# Altium project Acoustics_4.PrjPcb
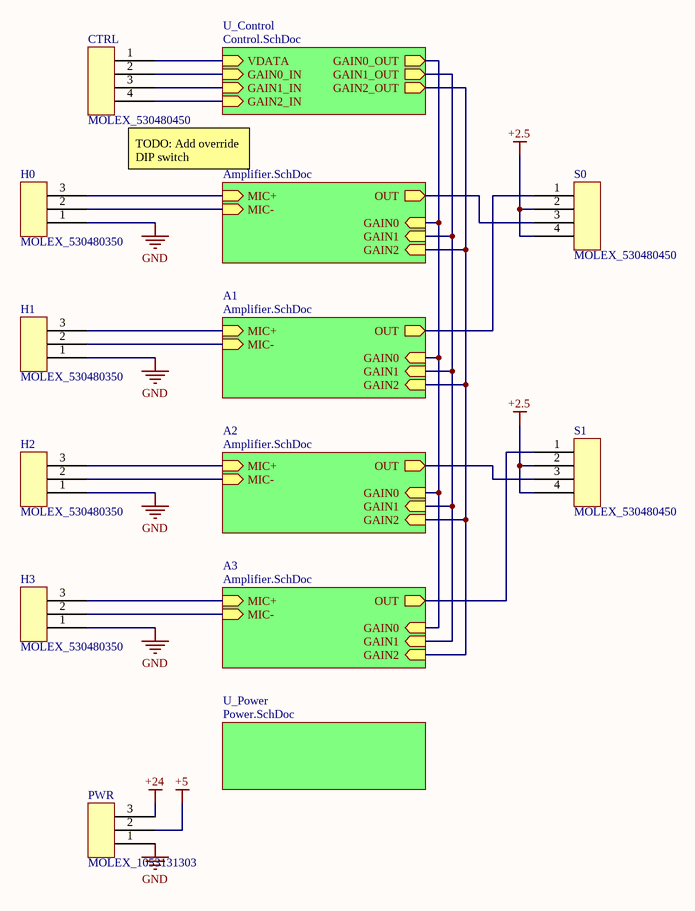
[diagram p0: Acoustics_4.SchDoc]
3 sheets, 110 parts. Net scope: hierarchical (ports join the sheet entries above them; power ports are global).
Board file: Acoustics_4.PcbDoc
Sheets:
  Acoustics_4.SchDoc
    A0 = Amplifier.SchDoc
    A1 = Amplifier.SchDoc
    A2 = Amplifier.SchDoc
    A3 = Amplifier.SchDoc
    U_Power = Power.SchDoc

## Sheet Acoustics_4.SchDoc
size A; SheetNumber: 1; SheetTotal: 4

### Parts
CTRL  MOLEX_530480450  [MOLEX_530480450]
H0  MOLEX_530480350  [MOLEX_530480350]
H1  MOLEX_530480350  [MOLEX_530480350]
H2  MOLEX_530480350  [MOLEX_530480350]
H3  MOLEX_530480350  [MOLEX_530480350]
PWR  MOLEX_1053131303  [MOLEX_1053131303]
S0  MOLEX_530480450  [MOLEX_530480450]
S1  MOLEX_530480450  [MOLEX_530480450]

### Sub-sheets
A0 = Amplifier.SchDoc: MIC- (in), MIC+ (in), GAIN2 (in), GAIN1 (in), GAIN0 (in), OUT (out)
A1 = Amplifier.SchDoc: MIC- (in), MIC+ (in), GAIN2 (in), GAIN1 (in), GAIN0 (in), OUT (out)
A2 = Amplifier.SchDoc: MIC- (in), MIC+ (in), GAIN2 (in), GAIN1 (in), GAIN0 (in), OUT (out)
A3 = Amplifier.SchDoc: MIC- (in), MIC+ (in), GAIN2 (in), GAIN1 (in), GAIN0 (in), OUT (out)
U_Control = Control.SchDoc (file not in this document): VDATA (in), GAIN0_OUT (out), GAIN1_OUT (out), GAIN2_OUT (out), GAIN0_IN (in), GAIN1_IN (in), GAIN2_IN (in)
U_Power = Power.SchDoc: no entries

### Nets
+2.5: S0.2 S0.4 S1.2 S1.4
+5: PWR.2
+24: PWR.3
GND: H0.1 H1.1 H2.1 H3.1 PWR.1
NetC1_A0_1: H0.2 ; sheet A0/MIC-
NetC1_A1_1: H1.2 ; sheet A1/MIC-
NetC1_A2_1: H2.2 ; sheet A2/MIC-
NetC1_A3_1: H3.2 ; sheet A3/MIC-
NetC2_A0_1: H0.3 ; sheet A0/MIC+
NetC2_A1_1: H1.3 ; sheet A1/MIC+
NetC2_A2_1: H2.3 ; sheet A2/MIC+
NetC2_A3_1: H3.3 ; sheet A3/MIC+
NetCTRL_1: CTRL.1 ; sheet U_Control/VDATA
NetCTRL_2: CTRL.2 ; sheet U_Control/GAIN0_IN
NetCTRL_3: CTRL.3 ; sheet U_Control/GAIN1_IN
NetCTRL_4: CTRL.4 ; sheet U_Control/GAIN2_IN
NetS0_1: S0.1 ; sheet A1/OUT
NetS0_3: S0.3 ; sheet A0/OUT
NetS1_1: S1.1 ; sheet A3/OUT
NetS1_3: S1.3 ; sheet A2/OUT
NetU3_A0_5: sheet A0/GAIN0, sheet A1/GAIN0, sheet A2/GAIN0, sheet A3/GAIN0, sheet U_Control/GAIN0_OUT
NetU3_A0_6: sheet A0/GAIN1, sheet A1/GAIN1, sheet A2/GAIN1, sheet A3/GAIN1, sheet U_Control/GAIN1_OUT
NetU3_A0_7: sheet A0/GAIN2, sheet A1/GAIN2, sheet A2/GAIN2, sheet A3/GAIN2, sheet U_Control/GAIN2_OUT

### Notes on the sheet
- (near CTRL) TODO: Add override DIP switch

## Sheet Amplifier.SchDoc
size A; SheetNumber: 2; SheetTotal: 4
Used 4 times, as channels A0, A1, A2, A3. Parts and nets are listed once, with the designators drawn on the sheet.
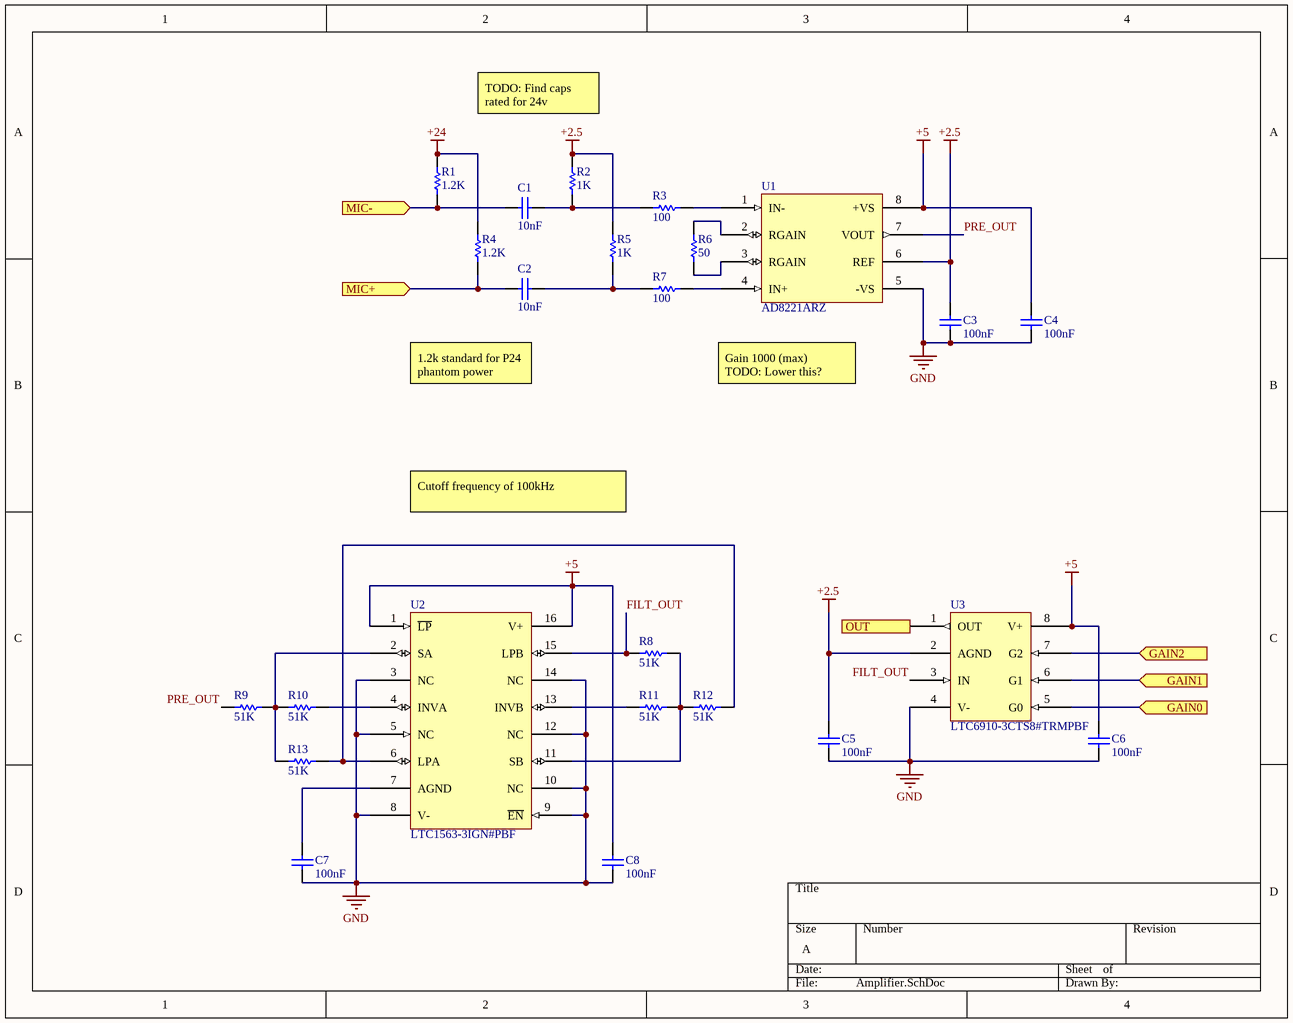
[diagram p1: Amplifier.SchDoc]

### Parts
C1  10nF  [CAPC1608X10M]
C2  10nF  [CAPC1608X10M]
C3  100nF  [CAPC1608X10M]
C4  100nF  [CAPC1608X10M]
C5  100nF  [CAPC1608X10M]
C6  100nF  [CAPC1608X10M]
C7  100nF  [CAPC1608X10M]
C8  100nF  [CAPC1608X10M]
R1  1.2K  [RESC1608X06M]
R2  1K  [RESC1608X06M]
R3  100  [RESC1608X06M]
R4  1.2K  [RESC1608X06M]
R5  1K  [RESC1608X06M]
R6  50  [RESC1608X06M]
R7  100  [RESC1608X06M]
R8  51K  [RESC1608X06M]
R9  51K  [RESC1608X06M]
R10  51K  [RESC1608X06M]
R11  51K  [RESC1608X06M]
R12  51K  [RESC1608X06M]
R13  51K  [RESC1608X06M]
U1  AD8221ARZ  [SOIC127P600X150-8M]
U2  LTC1563-3IGN#PBF  [SOP64P600X175-16M]
U3  LTC6910-3CTS8#TRMPBF  [TSOP65P280X100-8M]

### Ports
GAIN0 (in), GAIN1 (in), GAIN2 (in), MIC+ (in), MIC- (in), OUT (out)

### Nets
+2.5: C3.2 C5.2 R2.2 R5.2 U1.6(REF) U3.2(AGND)
+5: C4.2 C6.2 C8.2 U1.8(+VS) U2.1(~{LP}) U2.16(V+) U3.8(V+)
+24: R1.2 R4.2
GND: C3.1 C4.1 C5.1 C6.1 C7.1 C8.1 U1.5(-VS) U2.3(NC) U2.5(NC) U2.8(V-) U2.9(~{EN}) U2.10(NC) U2.12(NC) U2.14(NC) U3.4(V-)
FILT_OUT: R8.2 U2.15(LPB) U3.3(IN)
GAIN0: U3.5(G0) ; port GAIN0
GAIN1: U3.6(G1) ; port GAIN1
GAIN2: U3.7(G2) ; port GAIN2
MIC+: C2.1 R4.1 ; port MIC+
MIC-: C1.1 R1.1 ; port MIC-
OUT: U3.1(OUT) ; port OUT
PRE_OUT: R9.2 U1.7(VOUT)
NetC1_2: C1.2 R2.1 R3.2
NetC2_2: C2.2 R5.1 R7.2
NetC7_2: C7.2 U2.7(AGND)
NetR3_1: R3.1 U1.1(IN-)
NetR6_1: R6.1 U1.3(RGAIN)
NetR6_2: R6.2 U1.2(RGAIN)
NetR7_1: R7.1 U1.4(IN+)
NetR8_1: R8.1 R11.1 R12.2 U2.11(SB)
NetR9_1: R9.1 R10.2 R13.1 U2.2(SA)
NetR10_1: R10.1 U2.4(INVA)
NetR11_2: R11.2 U2.13(INVB)
NetR12_1: R12.1 R13.2 U2.6(LPA)

### Channels
A0: designators end in _A0; ports GAIN0=NetU3_A0_5 GAIN1=NetU3_A0_6 GAIN2=NetU3_A0_7 MIC+=NetC2_A0_1 MIC-=NetC1_A0_1 OUT=NetS0_3
A1: designators end in _A1; ports GAIN0=NetU3_A0_5 GAIN1=NetU3_A0_6 GAIN2=NetU3_A0_7 MIC+=NetC2_A1_1 MIC-=NetC1_A1_1 OUT=NetS0_1
A2: designators end in _A2; ports GAIN0=NetU3_A0_5 GAIN1=NetU3_A0_6 GAIN2=NetU3_A0_7 MIC+=NetC2_A2_1 MIC-=NetC1_A2_1 OUT=NetS1_3
A3: designators end in _A3; ports GAIN0=NetU3_A0_5 GAIN1=NetU3_A0_6 GAIN2=NetU3_A0_7 MIC+=NetC2_A3_1 MIC-=NetC1_A3_1 OUT=NetS1_1

### Notes on the sheet
- TODO: Find caps rated for 24v
- 1.2k standard for P24 phantom power
- Gain 1000 (max)
  TODO: Lower this?
- Cutoff frequency of 100kHz

### Library data of the parts
C1-C8 = GRM188: GRM188 0603(1.6mm*0.8mm) ±5% and ±10% (15pF-2.2uF) SMD Capacitor; Published: 8-Jun-2000; LatestRevisionDate: 17-Jul-2002; LatestRevisionNote: Re-released for DXP Platform.; PackageReference: RAD-0.3; Publisher: Altium Limited; PackageDescription: Radial Cap, Thru-Hole; 2 Leads; 0.3 in Pin Spacing
R1-R13 = RC0603_JR07: RC0603 JR-07 0603 (1.6mm*0.8mm) ±1% 1% (0R-4.7MR) chip resistor; Published: 8-Jun-2000; LatestRevisionDate: 17-Jul-2002; LatestRevisionNote: Re-released for DXP Platform.; PackageReference: AXIAL-0.3; Publisher: Altium Limited; PackageDescription: Axial Device, Thru-Hole; 2 Leads; 0.3 in Pin Spacing
U1 = AD8221ARZ: IC INST AMP 1 CIRCUIT 8SOIC; ComponentLink1Description: New link; ComponentLink1URL: https://www.analog.com/media/en/technical-documentation/data-sheets/AD8221.pdf
U2 = LTC1563-3IGN#PBF: IC FILTER 256KHZ LOWPASS BESSEL 16SSOP; ComponentLink1Description: Datasheet; ComponentLink1URL: https://www.analog.com/media/en/technical-documentation/data-sheets/156323fa.pdf
U3 = LTC6910-3CTS8#TRMPBF: Programmable Gain Amplifier 1 Circuit Rail-to-Rail TSOT-23-8; ComponentLink1Description: Datasheet; ComponentLink1URL: https://www.analog.com/media/en/technical-documentation/data-sheets/6910fb.pdf

## Sheet Power.SchDoc
size A; SheetNumber: 4; SheetTotal: 4
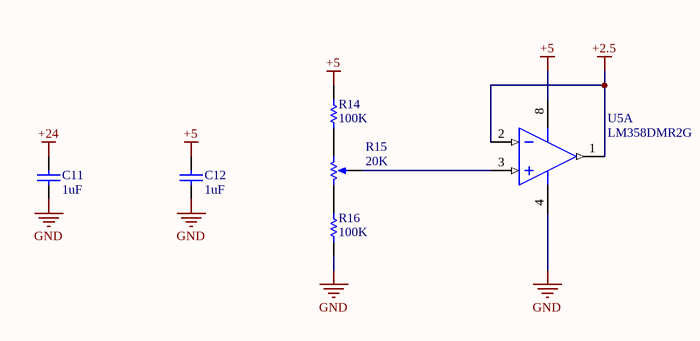
[diagram p2: Power.SchDoc]

### Parts
C11  1uF  [CAPC1608X10M]
C12  1uF  [CAPC1608X10M]
R14  100K  [RESC1608X06M]
R15  20K  [TC33X-1_BRN]
R16  100K  [RESC1608X06M]
U5  LM358DMR2G  [ONSC-MICRO-8-846A-02_H_V]  (part A of 2)

### Nets
+2.5: U5.1(OUTA) U5.2(INA-)
+5: C12.2 R14.2 U5.8(VCC)
+24: C11.2
GND: C11.1 C12.1 R16.1 U5.4(VEE/GND)
NetR14_1: R14.1 R15.1(TOP)
NetR15_2: R15.2(BOT) R16.2
NetR15_3: R15.3(TAP) U5.3(INA+)

### Library data of the parts
C11 C12 = GRM188: as C1 on sheet Amplifier; Published: 8-Jun-2000; LatestRevisionDate: 17-Jul-2002; LatestRevisionNote: Re-released for DXP Platform.; PackageReference: RAD-0.3; Publisher: Altium Limited; PackageDescription: Radial Cap, Thru-Hole; 2 Leads; 0.3 in Pin Spacing
R14 R16 = RC0603_JR07: as R1 on sheet Amplifier; Published: 8-Jun-2000; LatestRevisionDate: 17-Jul-2002; LatestRevisionNote: Re-released for DXP Platform.; PackageReference: AXIAL-0.3; Publisher: Altium Limited; PackageDescription: Axial Device, Thru-Hole; 2 Leads; 0.3 in Pin Spacing
R15 = TC33X-1-203E: TRIMMER 20K OHM 0.1W J LEAD TOP; pin to pad: 2>3 3>2; Sim Note: Enter the Resistance value and the set point into parameter fields.; Set Position: 0.5; Published: 8-Jun-2000; LatestRevisionDate: 17-Jul-2002; LatestRevisionNote: Re-released for DXP Platform.; PackageReference: VR5; Publisher: Altium Limited; PackageDescription: Variable Resistor, Thru-Hole; 3 Leads; Value: 20K
U5 = CMP-1310-00018-1: Single Supply Dual Operational Amplifier, 3 to 32 V, 0 to 70 degC, 8-Pin MICRO, Pb-Free, Tape and Reel; Manufacturer: On Semiconductor; VCC Min (V): 3; VCC Max (V): 32; PackageDescription: 8-Pin Small Outline Package, Body 3 x 3 mm, Pitch 0.65 mm; ComponentLink2URL: http://www.onsemi.cn/pub_link/Collateral/LM358-D.PDF; ComponentLink2Description: Datasheet; ComponentLink1Description: Manufacturer URL; PackageVersion: Rev. H; Packing: Tape and Reel; RoHS: TRUE; DatasheetVersion: Rev. 27; PartNumber: LM358DMR2G; ComponentLink3Description: Package Specification; ComponentLink1URL: http://www.onsemi.com/; Mounting Technology: Surface Mount; ComponentLink3URL: http://www.onsemi.com/pub_link/Collateral/NLSV2T244-D.PDF; PackageReference: MICRO-8-846A-02_H

## Nets that join several sheets
+2.5: Acoustics_4 (S0.2 S0.4 S1.2 S1.4), A0 (6 pins), A1 (6 pins), A2 (6 pins), A3 (6 pins), Power (U5.1 U5.2)
+5: Acoustics_4 (PWR.2), A0 (7 pins), A1 (7 pins), A2 (7 pins), A3 (7 pins), Power (C12.2 R14.2 U5.8)
+24: Acoustics_4 (PWR.3), A0 (R1_A0.2 R4_A0.2), A1 (R1_A1.2 R4_A1.2), A2 (R1_A2.2 R4_A2.2), A3 (R1_A3.2 R4_A3.2), Power (C11.2)
GND: Acoustics_4 (5 pins), A0 (15 pins), A1 (15 pins), A2 (15 pins), A3 (15 pins), Power (C11.1 C12.1 R16.1 U5.4)
NetC1_A0_1: Acoustics_4 (H0.2), A0 (C1_A0.1 R1_A0.1)
NetC1_A1_1: Acoustics_4 (H1.2), A1 (C1_A1.1 R1_A1.1)
NetC1_A2_1: Acoustics_4 (H2.2), A2 (C1_A2.1 R1_A2.1)
NetC1_A3_1: Acoustics_4 (H3.2), A3 (C1_A3.1 R1_A3.1)
NetC2_A0_1: Acoustics_4 (H0.3), A0 (C2_A0.1 R4_A0.1)
NetC2_A1_1: Acoustics_4 (H1.3), A1 (C2_A1.1 R4_A1.1)
NetC2_A2_1: Acoustics_4 (H2.3), A2 (C2_A2.1 R4_A2.1)
NetC2_A3_1: Acoustics_4 (H3.3), A3 (C2_A3.1 R4_A3.1)
NetS0_1: Acoustics_4 (S0.1), A1 (U3_A1.1)
NetS0_3: Acoustics_4 (S0.3), A0 (U3_A0.1)
NetS1_1: Acoustics_4 (S1.1), A3 (U3_A3.1)
NetS1_3: Acoustics_4 (S1.3), A2 (U3_A2.1)
NetU3_A0_5: A0 (U3_A0.5), A1 (U3_A1.5), A2 (U3_A2.5), A3 (U3_A3.5)
NetU3_A0_6: A0 (U3_A0.6), A1 (U3_A1.6), A2 (U3_A2.6), A3 (U3_A3.6)
NetU3_A0_7: A0 (U3_A0.7), A1 (U3_A1.7), A2 (U3_A2.7), A3 (U3_A3.7)